# EAGLE design Brunnenwasseradaper (EAGLE 9.6.2)
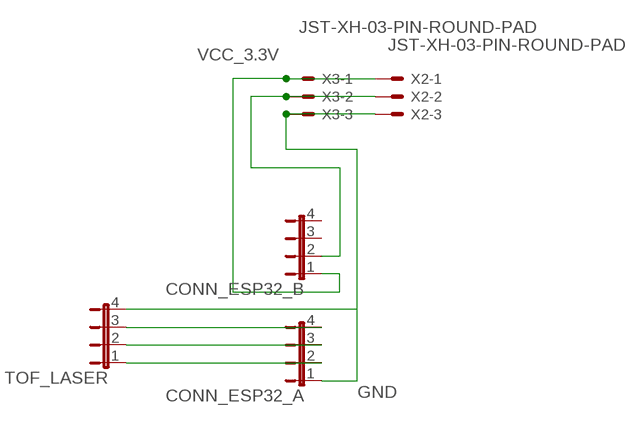
[diagram p0: schematic, sheet 1]

## Parts
CONN_ESP32_A  JP4E  [JP4]
CONN_ESP32_B  JP4E  [JP4]
TOF_LASER  JP4E  [JP4]
X2  JST-XH-03-PIN-ROUND-PAD  [JST-XH-03-PACKAGE-ROUND-PAD]
X3  JST-XH-03-PIN-ROUND-PAD  [JST-XH-03-PACKAGE-ROUND-PAD]

## Nets
GND: CONN_ESP32_A.1 TOF_LASER.4 X2.3 X3.3
N$1: CONN_ESP32_A.3 TOF_LASER.2
N$2: CONN_ESP32_A.4 TOF_LASER.3
N$3: CONN_ESP32_A.2 TOF_LASER.1
N$11: CONN_ESP32_B.2 X2.2 X3.2
VCC_3.3V: CONN_ESP32_B.1 X2.1 X3.1
Unconnected: CONN_ESP32_B.3 CONN_ESP32_B.4

## Library data of the parts
CONN_ESP32_A CONN_ESP32_B TOF_LASER = jumper:JP4E: JUMPER
X2 X3 = Rembrandt Electronics - JST XH Connectors v1-0:JST-XH-03-PIN: JST XH Connector 2 Pin Wire to board connector. Pitch: 2,54 mm, (0.100") Number of pins: 3 Created by Rembrandt Electronics www.rembrandtelectronics.com

## Board
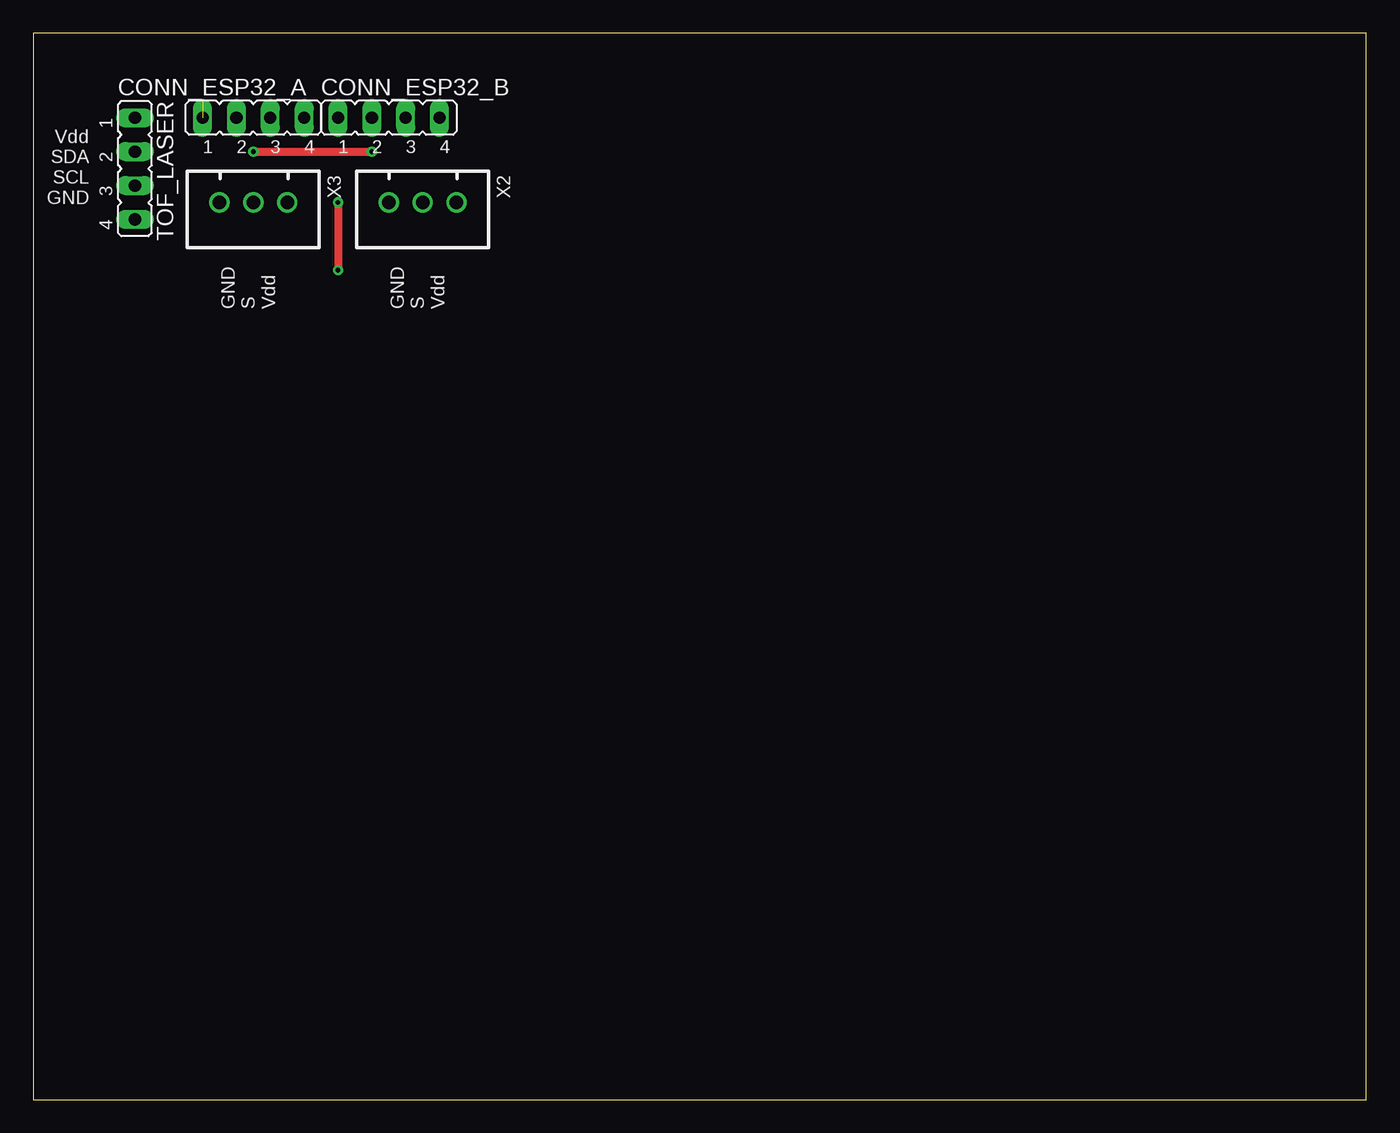
[diagram p1: board, top side]
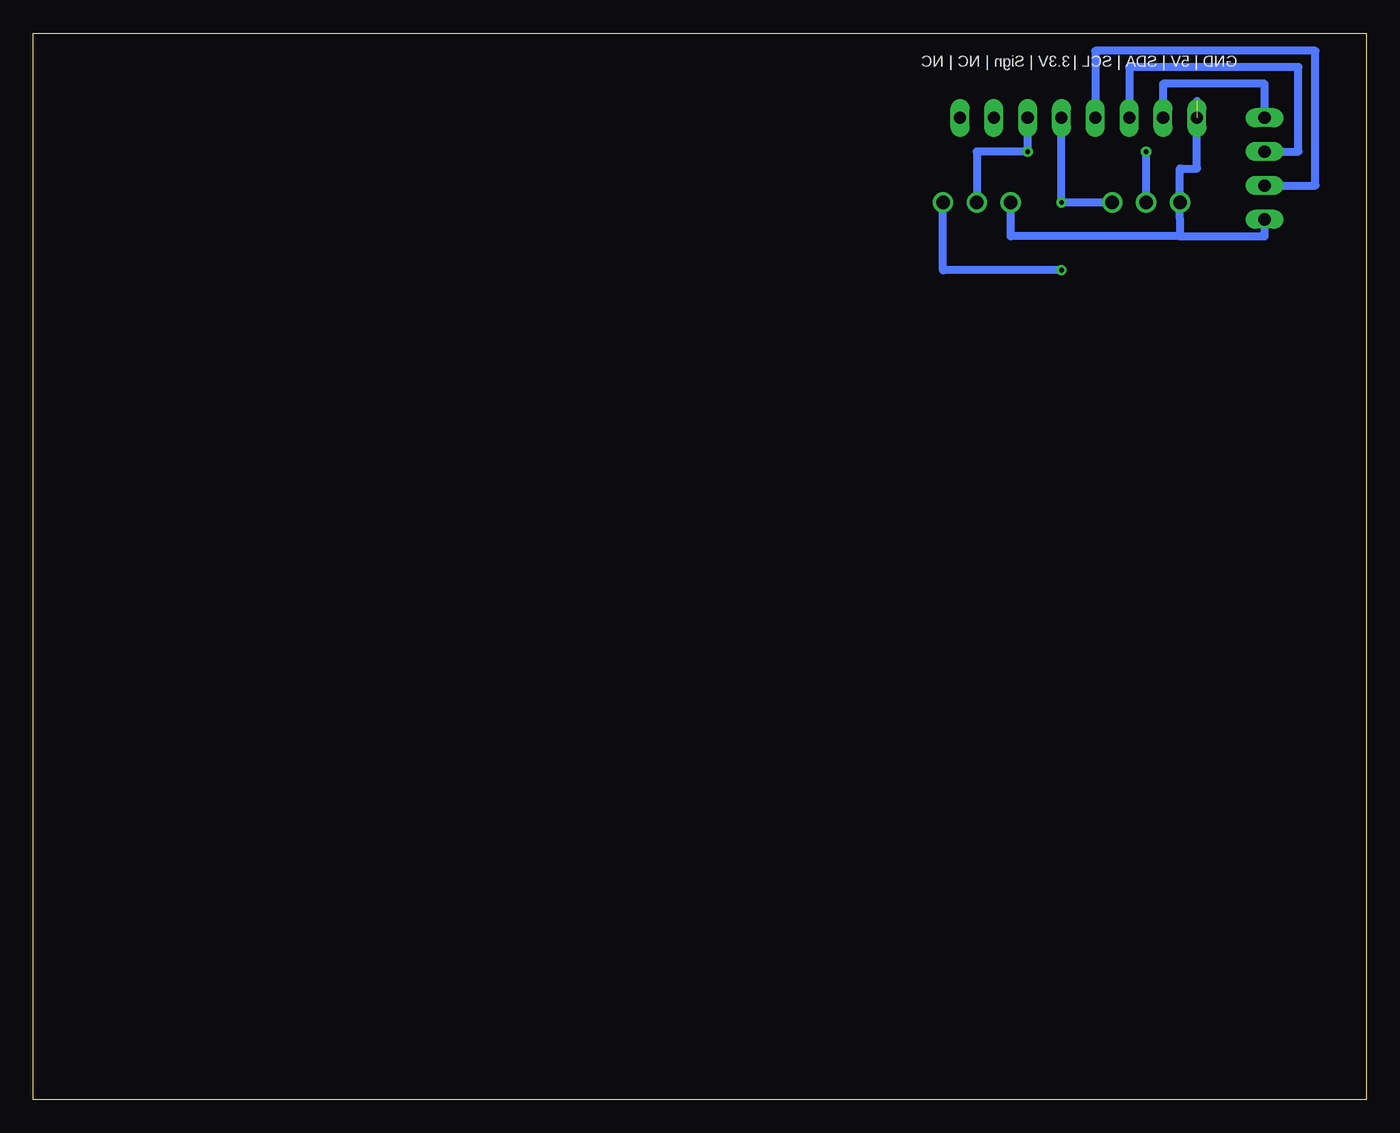
[diagram p2: board, bottom side, seen from below]

Size 100 x 80 mm. Coordinates in mm from the lower left corner, seen from the top.
Outline: 0,0 100,0 100,80 0,80 0,0
Copper layers (1*16): Top 0.035mm / dielectric 1.5mm / Bottom 0.035mm
Design rules "default": minimum track width 6mil, minimum drill 0.35mm, track to track 6mil, track to pad 6mil, pad to pad 6mil, via to via 6mil, smd to smd 6mil, copper to edge 40mil, drill to drill 6mil, minimum pad ring 10mil, minimum via ring 8mil, stop-mask expansion 4mil, vias tented up to drill 0mil, thermal gap 10mil

### Footprints (pad centres in the part's own frame; a part is rotated, then mirrored left to right if it is on the bottom)
JP4 = drill 0.914 long: 1 -3.81,0; 2 -1.27,0; 3 1.27,0; 4 3.81,0
JST-XH-03-PACKAGE-ROUND-PAD = drill 1.016: 1 -2.54,0; 2 0,0; 3 2.54,0

### Placement (x,y rotation side)
CONN_ESP32_A  16.51,73.66 0 top
CONN_ESP32_B  26.67,73.66 0 top
TOF_LASER  7.62,69.85 270 top
X2  29.21,67.31 180 top
X3  16.51,67.31 180 top

### Tracks (layer width: path | path; a pad name or v marks a point on that pad's centre or on a via)
GND  (1 unrouted)
  Bottom 0.61: 12.7,74.93 12.7,69.85 13.97,69.85 X3.3 13.97,66.04 13.97,64.77 | 13.97,64.77 26.67,64.77 X2.3 | 13.97,64.77 7.62,64.77 TOF_LASER.4
N$1
  Bottom 0.61: TOF_LASER.2 5.08,71.12 5.08,77.47 17.78,77.47 CONN_ESP32_A.3
N$2
  Bottom 0.61: TOF_LASER.3 3.81,68.58 3.81,78.68 20.32,78.68 CONN_ESP32_A.4
N$3
  Bottom 0.61: TOF_LASER.1 7.62,76.2 15.24,76.2 CONN_ESP32_A.2
N$11  (via drill 0.35)
  Top 0.61: v16.51,71.12 v25.4,71.12
  Bottom 0.61: X3.2 v16.51,71.12 | CONN_ESP32_B.2 v25.4,71.12 29.21,71.12 X2.2
VCC_3.3V  (via drill 0.35)
  Top 0.61: v22.86,67.31 v22.86,62.23
  Bottom 0.61: X3.1 v22.86,67.31 CONN_ESP32_B.1 | v22.86,62.23 31.75,62.23 X2.1

### Text on the board
tNames: Vdd / SDA / SCL / GND | GND / S / Vdd | GND / S / Vdd
bNames: GND | 5V | SDA | SCL | | 3.3V | Sign | NC | NC